# Altium schematic sheet MCU.SchDoc
size Legal; CompanyName: Penn Electric Racing; Organization: Penn Electric Racing; Address1: 220 S. 33rd St; Address2: Towne Bldg, B11; Address3: Philadelpia, PA 19104; Address4: USA; SheetNumber: 5; SheetTotal: 12
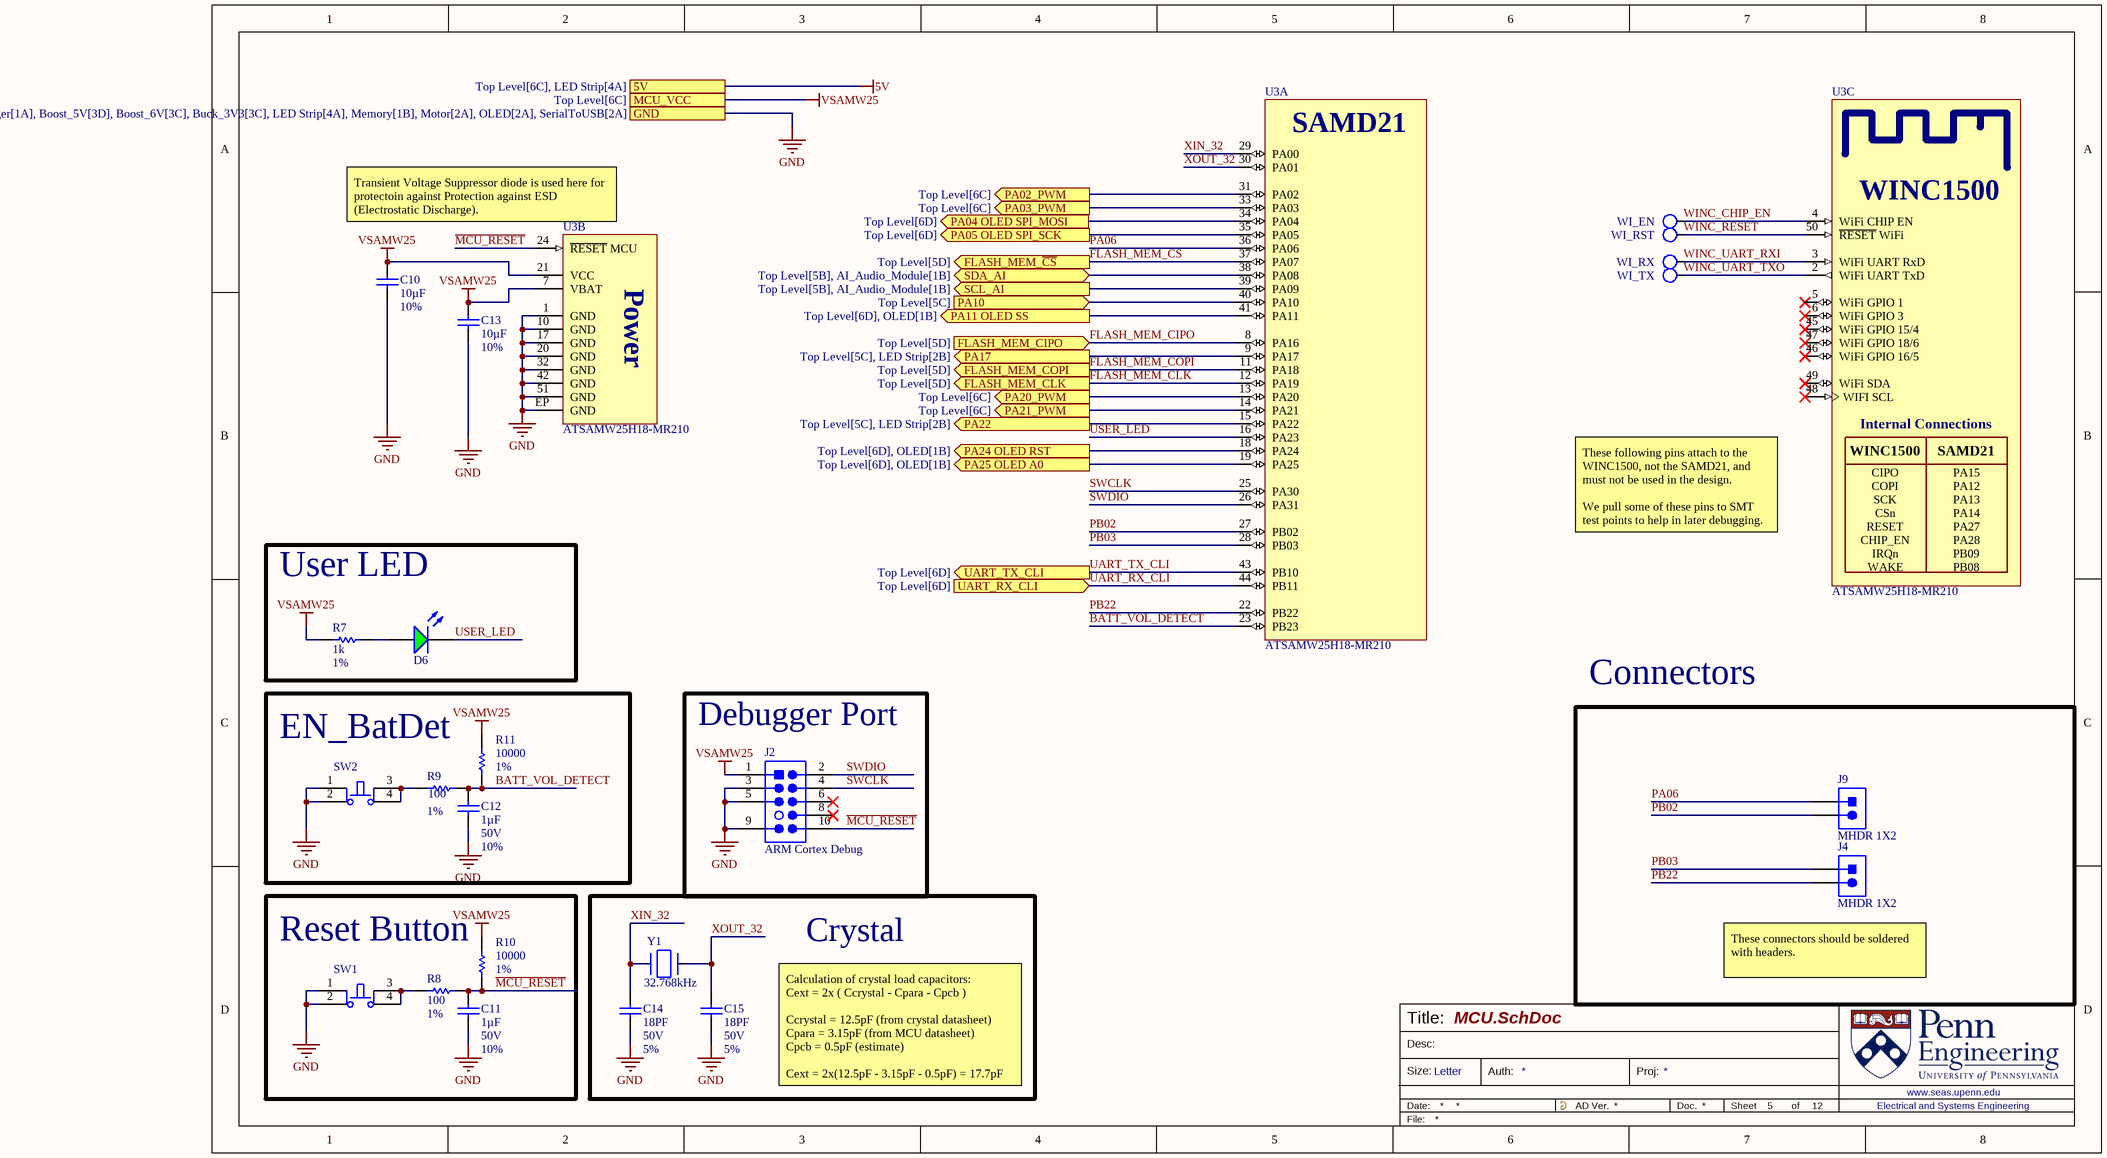
[diagram p0: MCU.SchDoc]

## Parts
C10  value 10µF  Tolerance: 10%  [1206_CAP]  (hidden comment: CAP 1206 10UF 50V 10% X5R)
C11  value 1µF  Voltage: 50V  Tolerance: 10%  [0603_CAP]  (hidden comment: CAP 0603 1UF 50V 10% X7R)
C12  value 1µF  Voltage: 50V  Tolerance: 10%  [0603_CAP]  (hidden comment: CAP 0603 1UF 50V 10% X7R)
C13  value 10µF  Tolerance: 10%  [1206_CAP]  (hidden comment: CAP 1206 10UF 50V 10% X5R)
C14  value 18PF  Voltage: 50V  Tolerance: 5%  [0603_CAP]  (hidden comment: CAP 0603 18PF 50V 5% C0G)
C15  value 18PF  Voltage: 50V  Tolerance: 5%  [0603_CAP]  (hidden comment: CAP 0603 18PF 50V 5% C0G)
D6  LSM0805452V  [LED_0805]  (value not drawn)
J2  ARM Cortex Debug  [FTSH-105-01-F-DV-007-K PLUGIN]
J4  MHDR 1X2  [PH1-02-UA]
J9  MHDR 1X2  [PH1-02-UA]
R7  value 1k  Tolerance: 1%  [0603_RES]  (hidden comment: RES 0603 1K 1%)
R8  value 100  Tolerance: 1%  [0603_RES]  (hidden comment: RES 0603 100 1%)
R9  value 100  Tolerance: 1%  [0603_RES]  (hidden comment: RES 0603 100 1%)
R10  value 10000  Tolerance: 1%  [0603_RES]  (hidden comment: RES 0603 10K 1%)
R11  value 10000  Tolerance: 1%  [0603_RES]  (hidden comment: RES 0603 10K 1%)
SW1  PTS810SJK250SMTRLFS  [PTS810SJK250SMTRLFS-Footprint-1]  (value not drawn)
SW2  PTS810SJK250SMTRLFS  [PTS810SJK250SMTRLFS-Footprint-1]  (value not drawn)
TP2  NetName: WI_TX  [SMT Testpoint, 50mil]  (hidden comment: Testpad)  (no BOM)
TP3  NetName: WI_RX  [SMT Testpoint, 50mil]  (hidden comment: Testpad)  (no BOM)
TP4  NetName: WI_RST  [SMT Testpoint, 50mil]  (hidden comment: Testpad)  (no BOM)
TP5  NetName: WI_EN  [SMT Testpoint, 50mil]  (hidden comment: Testpad)  (no BOM)
U3  ATSAMW25H18-MR210  [ATSAMW25H18-MR210-Footprint-1]  (parts A,B,C of 3)
Y1  Frequency: 32.768kHz  [FP-ABS07-MFG]  (hidden comment: ABS07-32.768KHZ-T)

## Blocks framed on the sheet
User LED: D6 R7
EN_BatDet: C12 R9 R11 SW2
Debugger Port: J2
Connectors: J4 J9
Reset Button: C11 R8 R10 SW1
Crystal: C14 C15 Y1

## Ports
5V (see Top Level[6C], LED Strip[4A]), FLASH_MEM_CIPO (in, see Top Level[5D]), FLASH_MEM_CLK (out, see Top Level[5D]), FLASH_MEM_COPI (out, see Top Level[5D]), FLASH_MEM_~{CS} (out, see Top Level[5D]), GND (see Top Level[6C], AI_Audio_Module[4A], BatteryCharger[1A], Boost_5V[3D], Boost_6V[3C], Buck_3V3[3C], LED Strip[4A], Memory[1B], Motor[2A], OLED[2A], SerialToUSB[2A]), MCU_VCC (see Top Level[6C]), PA02_PWM (out, see Top Level[6C]), PA03_PWM (out, see Top Level[6C]), PA04 OLED SPI_MOSI (out, see Top Level[6D]), PA05 OLED SPI_SCK (out, see Top Level[6D]), PA10 (in, see Top Level[5C]), PA11 OLED SS (out, see Top Level[6D], OLED[1B]), PA17 (out, see Top Level[5C], LED Strip[2B]), PA20_PWM (out, see Top Level[6C]), PA21_PWM (out, see Top Level[6C]), PA22 (out, see Top Level[5C], LED Strip[2B]), PA24 OLED RST (out, see Top Level[6D], OLED[1B]), PA25 OLED A0 (out, see Top Level[6D], OLED[1B]), SCL_AI (out, see Top Level[5B], AI_Audio_Module[1B]), SDA_AI (bidir, see Top Level[5B], AI_Audio_Module[1B]), UART_RX_CLI (in, see Top Level[6D]), UART_TX_CLI (out, see Top Level[6D])

## Nets
5V: port 5V
GND: C10.1 C11.1 C12.1 C13.1 C14.1 C15.1 J2.3 J2.5 J2.9 SW1.1 SW1.2 SW2.1 SW2.2 U3.1(GND) U3.10(GND) U3.17(GND) U3.20(GND) U3.32(GND) U3.42(GND) U3.51(GND) U3.EP(GND) ; port GND
VSAMW25: C10.2 C13.2 J2.1 R7.1 R10.2 R11.2 U3.7(VBAT) U3.21(VCC) ; port MCU_VCC
BATT_VOL_DETECT: C12.2 R9.2 R11.1 U3.23(PB23)
FLASH_MEM_~{CS}: U3.37(PA07) ; port FLASH_MEM_~{CS}
FLASH_MEM_CIPO: U3.8(PA16) ; port FLASH_MEM_CIPO
FLASH_MEM_CLK: U3.12(PA19) ; port FLASH_MEM_CLK
FLASH_MEM_COPI: U3.11(PA18) ; port FLASH_MEM_COPI
~{MCU_RESET}: C11.2 J2.10 R8.2 R10.1 U3.24(~{RESET}_MCU)
PA02_PWM: U3.31(PA02) ; port PA02_PWM
PA03_PWM: U3.33(PA03) ; port PA03_PWM
PA04 OLED SPI_MOSI: U3.34(PA04) ; port PA04 OLED SPI_MOSI
PA05 OLED SPI_SCK: U3.35(PA05) ; port PA05 OLED SPI_SCK
PA06: J9.1 U3.36(PA06)
PA10: U3.40(PA10) ; port PA10
PA11 OLED SS: U3.41(PA11) ; port PA11 OLED SS
PA17: U3.9(PA17) ; port PA17
PA20_PWM: U3.13(PA20) ; port PA20_PWM
PA21_PWM: U3.14(PA21) ; port PA21_PWM
PA22: U3.15(PA22) ; port PA22
PA24 OLED RST: U3.18(PA24) ; port PA24 OLED RST
PA25 OLED A0: U3.19(PA25) ; port PA25 OLED A0
PB02: J9.2 U3.27(PB02)
PB03: J4.1 U3.28(PB03)
PB22: J4.2 U3.22(PB22)
SCL_AI: U3.39(PA09) ; port SCL_AI
SDA_AI: U3.38(PA08) ; port SDA_AI
SWCLK: J2.4 U3.25(PA30)
SWDIO: J2.2 U3.26(PA31)
UART_RX_CLI: U3.44(PB11) ; port UART_RX_CLI
UART_TX_CLI: U3.43(PB10) ; port UART_TX_CLI
USER_LED: D6.K U3.16(PA23)
WINC_CHIP_EN: TP5.1 U3.4(WiFi_CHIP_EN)
WINC_RESET: TP4.1 U3.50(~{RESET}_WiFi)
WINC_UART_RXI: TP3.1 U3.3(WiFi_UART_RxD)
WINC_UART_TXO: TP2.1 U3.2(WiFi_UART_TxD)
XIN_32: C14.2 U3.29(PA00) Y1.1
XOUT_32: C15.2 U3.30(PA01) Y1.2
NetD6_A: D6.A R7.2
NetR8_1: R8.1 SW1.3 SW1.4
NetR9_1: R9.1 SW2.3 SW2.4

Not connected (* = marked no-connect by the designer): J2 6* 8*; U3 5(WiFi_GPIO_1)* 6(WiFi_GPIO_3)* 45(WiFi_GPIO_15/4)* 46(WiFi_GPIO_16/5)* 47(WiFi_GPIO_18/6)* 48(WIFI_SCL)* 49(WiFi_SDA)*

## Notes on the sheet
- (near U3) Transient Voltage Suppressor diode is used here for protectoin against Protection against ESD (Electrostatic Discharge).
- These following pins attach to the WINC1500, not the SAMD21, and must not be used in the design.
  We pull some of these pins to SMT test points to help in later debugging.
- (near J4) These connectors should be soldered with headers.
- Calculation of crystal load capacitors:
  Cext = 2x ( Ccrystal - Cpara - Cpcb )
  Ccrystal = 12.5pF (from crystal datasheet)
  Cpara = 3.15pF (from MCU datasheet)
  Cpcb = 0.5pF (estimate)
  Cext = 2x(12.5pF - 3.15pF - 0.5pF) = 17.7pF
- Title:
- Desc:
- Size:
- Letter
- Auth:
- Proj:
- Sheet
- of
- www.seas.upenn.edu
- Electrical and Systems Engineering
- (in symbol CMP-00071-11, part A) SAMD21
- (in symbol CMP-00071-11, part B) Power
- (in symbol CMP-00071-11, part C) WINC1500; Internal Connections; SAMD21; CIPO / COPI / SCK / CSn / RESET / CHIP_EN / IRQn / WAKE; PA15 / PA12 / PA13 / PA14 / PA27 / PA28 / PB09 / PB08

## Library data of the parts
C10 C13 = CMP-001-00003-5: Capacitor Surface Mount 1206 Footprint 10UF 25V 10% Tolerance Ceramic X5R; Manufacturer: Various; Description in Visual: Cap SMT 1206 10UF 50V 10%  Cer X5R; PCB Package: 1206; JLCPCB Part #: C13585; Type: Ceramic X5R; Mount: SMT; RoHS: Yes; P/N: CAP 1206 10UF 50V 10% X5R; Case/Package: 1206; Capacitor Type: Ceramic; Manufacturer P/N: CAP 1206 10UF 50V 10% X5R; Voltage: 50V
C11 C12 = CMP-011-000287-2: Capacitor Surface Mount 0603 Footprint 1UF 50V 10% Tolerance Ceramic X7R; Manufacturer: Various; Description in Visual: Cap SMT 0603 1UF 50V 10% Ceramic X7R; PCB Package: 0603; Manufacturer P/N: CAP 0603 1UF 50V 10% X7R; P/N: CAP 0603 1UF 50V 10% X7R; Type: Ceramic X7R; Mount: SMT; Capacitor Type: Ceramic; Case/Package: 0603; RoHS: Yes
C14 C15 = CMP-011-000283-1: Capacitor Surface Mount 0603 Footprint 18PF 50V 5% Tolerance Ceramic C0G; Manufacturer: Various; Description in Visual: Cap SMT 0603 18PF 50V 5%  Cer C0G; PCB Package: 0603; Type: Ceramic C0G; Manufacturer P/N: CAP 0603 18PF 50V 5% C0G; P/N: CAP 0603 18PF 50V 5% C0G; Mount: SMT
D6 = CMP-00038-4: Single Color LED, Green, 0805; Test Current: 20mA; Forward Voltage: 2V; Wavelength - Peak: 571nm; Package (Case): 0805; RoHS Compliant: Yes; Current: 20mA; Wavelength - Dominant: 571nm; Color: Green
J2 = CMP-002-000013-2: 10 Pin Shrouded Header, 0.050", Key Pin 7; Manufacturer P/N: Various; Manufacturer: Samtech; Gender: Male; Number of Contacts: 10; ComponentLink1URL: https://developer.arm.com/documentation/ka001776/1-0/?lang=en; Description in Visual: 10 Pin Shrouded Header, 0.050", Key Pin 7; P/N: ARM Cortex Debug; Number of Rows: 2; Contact Finish: Gold; ComponentLink1Description: Pinout Reference; ComponentLink2URL: http://suddendocs.samtec.com/catalog_english/ftsh_smt.pdf; Pitch: 0.050"; Orientation: Vertical; ComponentLink2Description: Datasheet for Connector
J4 J9 = CMP-000021-1: Header, 2-Pin, 0.1in Pitch, Male
R7 = CMP-005-002503-3: Resistor Surface Mount, 1K Ohms, 0603 Footprint, 1% Tolerance 0.1W; Manufacturer: Various; PCB Package: 0603; Description in Visual: Res SMT 1K 0603  1%  0.1W; JLCPCB Part #: C21190; Power Rating: 0.1W; Manufacturer P/N: RES 0603 1K 1%; Mount: SMT
R8 R9 = CMP-005-002125-2: Resistor Surface Mount, 100 Ohms, 0603 Footprint, 1% Tolerance 0.1W; Manufacturer P/N: RES 0603 100R 1%; Manufacturer: Various; Description in Visual: Res SMT 100 0603  1%  0.1W; PCB Package: 0603; Power Rating: 0.1W; Mount: SMT
R10 R11 = CMP-005-002156-3: Resistor Surface Mount, 10K Ohms, 0603 Footprint, 1% Tolerance 0.1W; Manufacturer: Various; Description in Visual: Res SMT 10K 0603  1%  0.1W; PCB Package: 0603; JLCPCB Part #: C25804; Manufacturer P/N: RES 0603 10K 1%; Power Rating: 0.1W; Mount: SMT
SW1 SW2 = CMP-00084-6: Keypad Switch, 1 Switches, SPST, Momentary tactile button, 0.05A, 16VDC, 3.23N, Solder Terminal, Surface Mount-straight; Manufacturer Series: PTS810; Actuator Length: 0.028inch; Electrical Life: 50000Cycles; Contact Resistance: 0.5mR; Solderability: REFLOW; Actuator Travel: 0.1524mm; Actuator Color: White; Actuator Type: Pushbutton; Insulation Resistance: 100MR; Dielectric Withstand Volts: 250VACV; Switch Function: OFF-MOM; Reach SVHC Compliant: Yes; Terminal Finish: Silver; Switch Type: Keypad; Switch Action: MOMENTARY; RoHS Compliant: Yes; JESD-609 Code: e4; Max Operating Temperature: 85°C; Termination: Solder; Min Operating Temperature: -40°C; Mounting Technology: Surface Mount; Circuit: SPST; Type: Tactile
TP2-TP5 = CMP-00049-8: Test Pad/Point (Testpoint, Testpad), for probing
U3 = CMP-00071-11: WiFi 802.11b/g/n Transceiver Module 2.412GHz ~ 2.484GHz Integrated, Trace Surface Mount, Integrated SAMD21 Cortex M0+; FCC ID: 2ADHKSAMW25; MCU Chipset: ATSAMD21G18A
Y1 = CMP-078-000002-2: Parallel - Fundamental Quartz Crystal, 0.032768MHz Nom; ESR: 70kR; Frequency Tolerance: 20ppm; Load Capacitance: 12.5pF; Additional Feature: TAPE AND REEL; Drive Level: 0.5uW; Aging: 3 PPM/FIRST YEAR; Max Operating Temperature: 85°C; Crystal/Resonator Type: PARALLEL - FUNDAMENTAL; Min Operating Temperature: -40°C; RoHS Compliant: Yes; Mounting Technology: Surface Mount; Reach SVHC Compliant: Yes; Operating Frequency-Nom: 0.032768